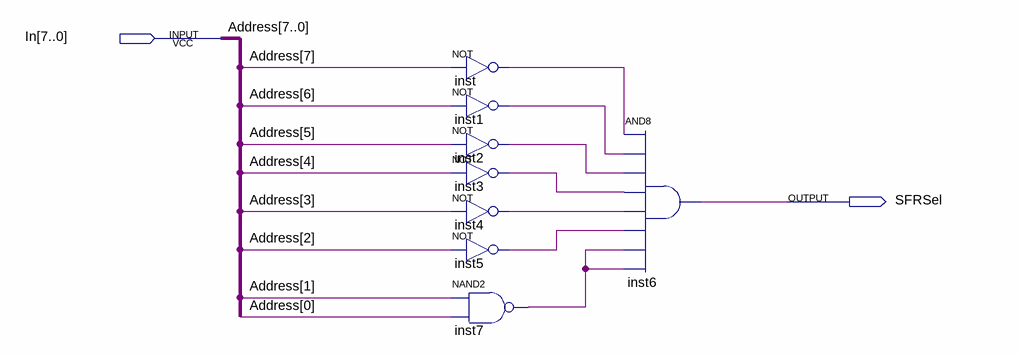
[diagram p0: schematic sheet]
// Quartus schematic SFRSel.bdf as structural Verilog: 8 symbols, 2 pins
module SFRSel (
  input  [7:0] In,
  output SFRSel
);

  wire inst1_out, inst2_out, inst3_out, inst4_out, inst5_out, inst7_out, inst_out;

  not inst (inst_out, In[7]);
  not inst1 (inst1_out, In[6]);
  not inst2 (inst2_out, In[5]);
  not inst3 (inst3_out, In[4]);
  not inst4 (inst4_out, In[3]);
  not inst5 (inst5_out, In[2]);
  nand inst7 (inst7_out, In[1], In[0]);
  and inst6 (SFRSel, inst_out, inst1_out, inst2_out, inst3_out, inst4_out, inst5_out, inst7_out, inst7_out);

  // Other names for the same wires on the sheet: Address[7:0] = In
endmodule
